# EAGLE design io (EAGLE 9.6.2)
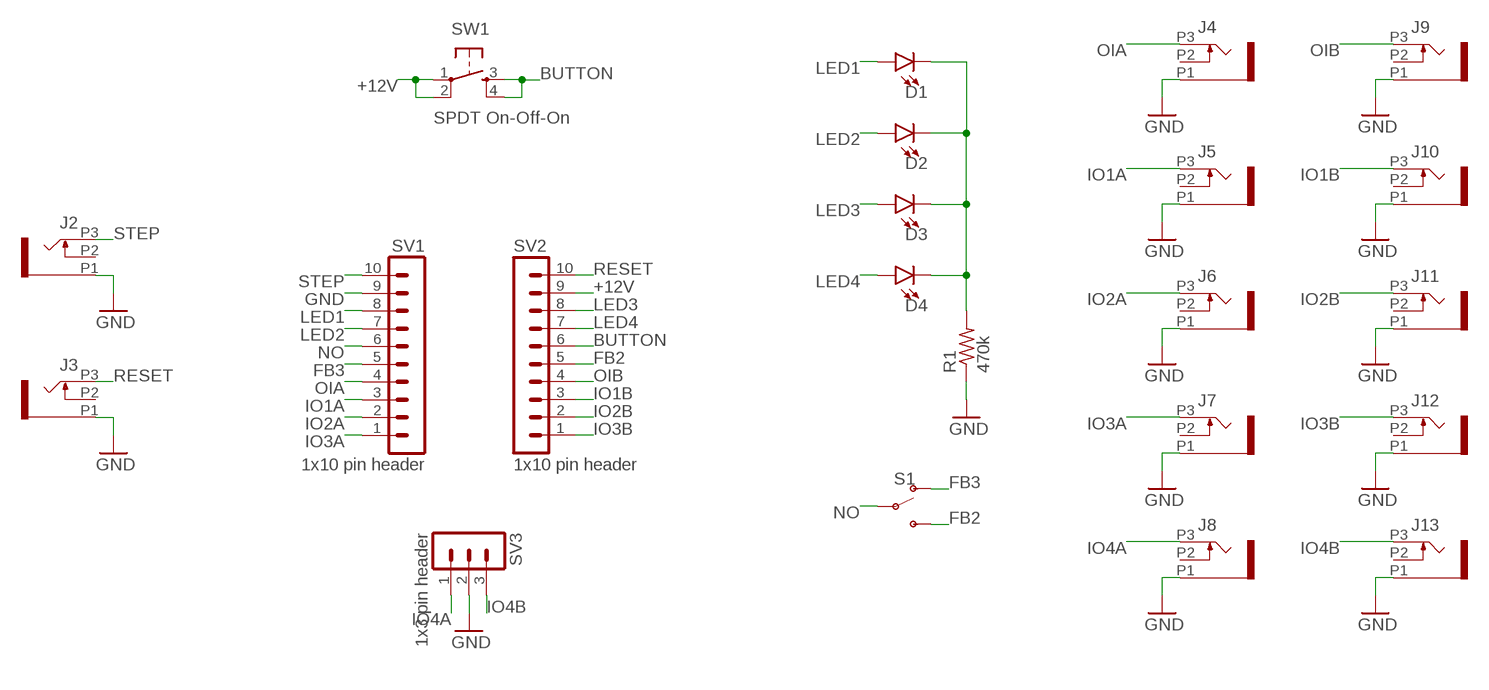
[diagram p0: schematic, sheet 1]

## Parts
D1  LED3MM  [LED_3MM]
D2  LED3MM  [LED_3MM]
D3  LED3MM  [LED_3MM]
D4  LED3MM  [LED_3MM]
J2  PJ301_THONKICONN6  [WQP_PJ_301M6]
J3  PJ301_THONKICONN6  [WQP_PJ_301M6]
J4  PJ301_THONKICONN6  [WQP_PJ_301M6]
J5  PJ301_THONKICONN6  [WQP_PJ_301M6]
J6  PJ301_THONKICONN6  [WQP_PJ_301M6]
J7  PJ301_THONKICONN6  [WQP_PJ_301M6]
J8  PJ301_THONKICONN6  [WQP_PJ_301M6]
J9  PJ301_THONKICONN6  [WQP_PJ_301M6]
J10  PJ301_THONKICONN6  [WQP_PJ_301M6]
J11  PJ301_THONKICONN6  [WQP_PJ_301M6]
J12  PJ301_THONKICONN6  [WQP_PJ_301M6]
J13  PJ301_THONKICONN6  [WQP_PJ_301M6]
R1  470k  R-US_R0603  [R0603]
S1  SWITCH-SPDT-PTH-11.6X4.0MM-SHORT_LEADS  [SWITCH_SPDT_PTH_11.6X4.0MM]
SV1  1x10 pin header  MA10-1  [MA10-1]
SV2  1x10 pin header  MA10-1  [MA10-1]
SV3  1x3 pin header  MA03-1  [MA03-1]
SW1  SPDT On-Off-On  TAC_SWITCHPTH  [TACTILE-PTH]

## Nets
+12V: SV2.9 SW1.1 SW1.2
BUTTON: SV2.6 SW1.3 SW1.4
FB2: S1.3(S) SV2.5
FB3: S1.1(O) SV1.5
GND: J2.P1 J3.P1 J4.P1 J5.P1 J6.P1 J7.P1 J8.P1 J9.P1 J10.P1 J11.P1 J12.P1 J13.P1 R1.1 SV1.9 SV3.2
IO1A: J5.P3 SV1.3
IO1B: J10.P3 SV2.3
IO2A: J6.P3 SV1.2
IO2B: J11.P3 SV2.2
IO3A: J7.P3 SV1.1
IO3B: J12.P3 SV2.1
IO4A: J8.P3 SV3.1
IO4B: J13.P3 SV3.3
LED1: D1.A SV1.8
LED2: D2.A SV1.7
LED3: D3.A SV2.8
LED4: D4.A SV2.7
N$5: D1.K(C) D2.K(C) D3.K(C) D4.K(C) R1.2
NO: S1.2(P) SV1.6
OIA: J4.P3 SV1.4
OIB: J9.P3 SV2.4
RESET: J3.P3 SV2.10
STEP: J2.P3 SV1.10
Unconnected: J2.P2 J3.P2 J4.P2 J5.P2 J6.P2 J7.P2 J8.P2 J9.P2 J10.P2 J11.P2 J12.P2 J13.P2

## Library data of the parts
D1-D4 = SparkFun-LED:LED: LED (Generic) Standard schematic elements and footprints for 5mm, 3mm, 1206, and 0603 sized LEDs. Generic LEDs with no color specified.; PROD_ID: DIO-08794
J2-J13 = og-pj301_variations:PJ301_THONKICONN
R1 = rcl:R-US_: RESISTOR, American symbol; SPICEPREFIX: R
S1 = SparkFun-Switches:SWITCH-SPDT: Single Pole, Double Throw (SPDT) Switch Single-pole, double-throw (SPDT) switch. Variant Overview SMD-AYZ0202 Surface Mount DPDT Switch <https://www.sparkfun.com/products/597> (COM-00597) Used on e.g. LilyPad Arduino USB - ATmega32U4 Board <https://www.sparkfun.com/products/12049> PTH-11.6X4.0MM SPDT Mini Power Switch <https://www.sparkfun.com/products/102> (COM-00102) Used on e.g. SparkFun Simon Says - Through-Hole Soldering Kit <https://www.sparkfun.com/products/10547> (KIT-10547) PTH-11.6X4.0MM-KIT KIT version of SPDT Mini Power Switch - Simplifies soldering by removing tStop of switch pins - only one side can be soldered. PTH-11.6X4.0MM-LOCK LOCK version of SPDT Mini Power Switch - Offset pins hold switch in place for easier soldering. SMD-RIGHT-ANGLE Surface Mount Right Angle Switch <https://www.sparkfun.com/products/10860> (COM-10860) Used on e.g. SparkFun ESP8266 Thing <https://www.sparkfun.com/products/13231>; PROD_ID: SWCH-13151
SV1 SV2 = con-lstb:MA10-1: PIN HEADER; OC_FARNELL: unknown; OC_NEWARK: unknown
SV3 = con-lstb:MA03-1: PIN HEADER; OC_FARNELL: unknown; OC_NEWARK: unknown
SW1 = SparkFun:TAC_SWITCH: Momentary Switch Button commonly used for reset or general input. Spark Fun Electronics SKU : COM-00097

## Net classes
0 default: width 0.406 mm, clearance 0.203 mm

## Board
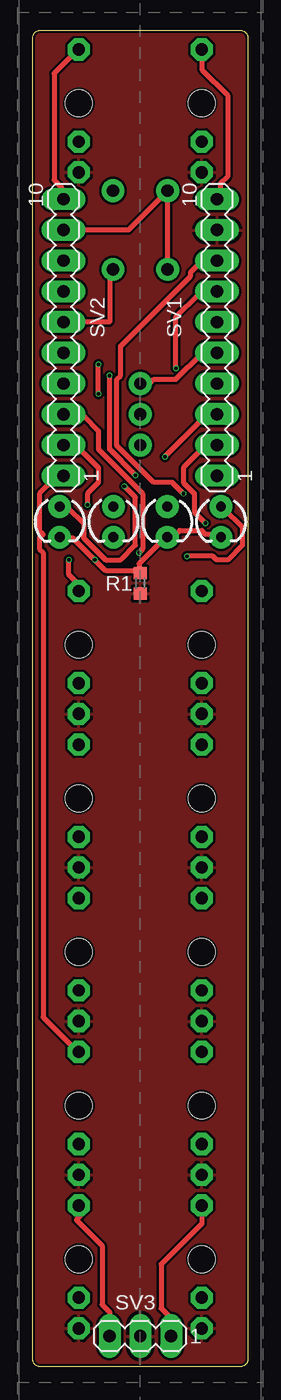
[diagram p1: board, top side]
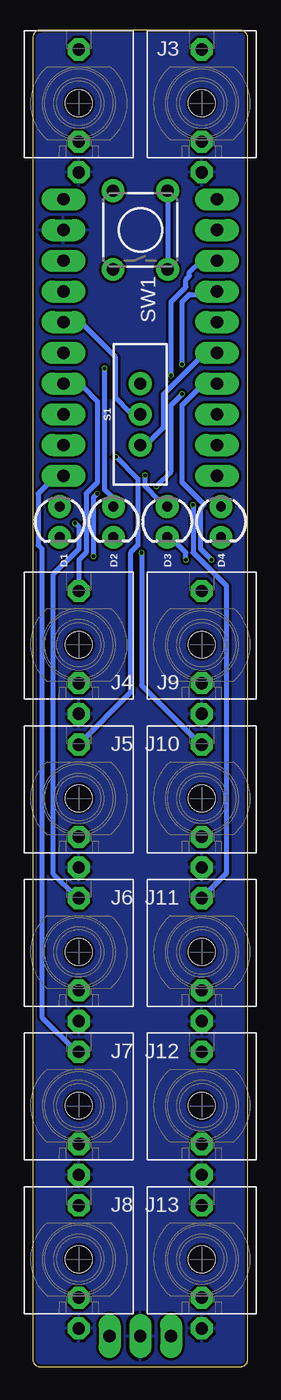
[diagram p2: board, bottom side, seen from below]

Size 17.78 x 110.49 mm. Coordinates in mm from the lower left corner, seen from the top.
Copper layers (1*16): Top 0.035mm / dielectric 1.6mm / Bottom 0.035mm
Design rules "jlcpcb-2layers *": minimum track width 5mil, minimum drill 0.3mm, track to track 5mil, track to pad 5mil, pad to pad 5mil, via to via 10mil, smd to smd 5mil, copper to edge 0.2mm, drill to drill 6mil, minimum pad ring 10mil, minimum via ring 3mil, stop-mask expansion 4mil, vias tented up to drill 0mil, thermal gap 10mil

### Footprints (pad centres in the part's own frame; a part is rotated, then mirrored left to right if it is on the bottom)
LED_3MM = drill 0.813 pad 1.88: A -1.27,0; K 1.27,0
WQP_PJ_301M6 = drill 1.016 pad 1.778 octagon: P1 0,-5.715; P2 0,-3.175; P3 0,4.445 | hole 2.2: 0,0
R0603 = smd 1 x 1.1: 1 -0.85,0; 2 0.85,0
SWITCH_SPDT_PTH_11.6X4.0MM = drill 1.016 pad 1.88: 1 0,2.54; 2 0,0; 3 0,-2.54
MA10-1 = drill 1.016 long: 1 -11.43,0; 2 -8.89,0; 3 -6.35,0; 4 -3.81,0; 5 -1.27,0; 6 1.27,0; 7 3.81,0; 8 6.35,0; 9 8.89,0; 10 11.43,0
MA03-1 = drill 1.016 long: 1 -2.54,0; 2 0,0; 3 2.54,0
TACTILE-PTH = drill 1.016 pad 1.88: 1 -3.251,2.261; 2 3.251,2.261; 3 -3.251,-2.261; 4 3.251,-2.261

### Placement (x,y rotation side)
D1  15.56,69.85 270 bottom
D2  11.11,69.85 270 bottom
D3  6.67,69.85 270 bottom
D4  2.22,69.85 270 bottom
J2  13.97,104.46 0 bottom
J3  3.81,104.46 0 bottom
J4  13.97,59.69 0 bottom
J5  13.97,46.99 0 bottom
J6  13.97,34.29 0 bottom
J7  13.97,21.59 0 bottom
J8  13.97,8.89 0 bottom
J9  3.81,59.69 0 bottom
J10  3.81,46.99 0 bottom
J11  3.81,34.29 0 bottom
J12  3.81,21.59 0 bottom
J13  3.81,8.89 0 bottom
R1  8.89,64.77 90 top
S1  8.89,78.74 0 bottom
SV1  15.24,85.09 90 top
SV2  2.54,85.09 90 top
SV3  8.89,2.54 180 top
SW1  8.89,93.98 90 bottom
U$1  [EURO_PCB_4HP]  -1.27,-8.89 0 top  (outside the outline)

### Tracks (layer width: path | path; a pad name or v marks a point on that pad's centre or on a via)
+12V
  Top 0.406: SW1.2 10.94,97.02 | 10.94,97.02 7.9,93.98 SV2.9 | SW1.1 11.15,96.8 10.94,97.02
BUTTON
  Top 0.406: SW1.3 6.35,90.45 6.35,86.36 SV2.6
  Bottom 0.406: SW1.4 SW1.3
FB2
  Bottom 0.406: SV2.5 2.69,83.77 3.61,83.77 6.96,80.42 6.96,77.67 8.18,76.45 8.79,76.45 S1.3
FB3
  Top 0.406: SV1.5 15.19,83.77 13.97,83.77 11.84,81.64 10.01,81.64 9.7,81.33 9.09,81.33 S1.1
GND
  pour Top: -1.27,110.49 19.05,110.49 19.05,0 -1.27,0
  pour Bottom: 0,110.49 17.78,110.49 17.78,0 0,0
IO1A  (via drill 0.3)
  Top 0.406: v10.92,75.23 14.28,78.59 15.19,78.59 SV1.3
  Bottom 0.406: v10.92,75.23 9.09,73.41 9.09,67.92 9.7,67.31 9.7,55.73 13.97,51.46 J5.P3
IO1B  (via drill 0.3)
  Top 0.406: v8.79,67.31 9.09,67.61 9.09,72.19 5.44,75.84 5.44,77.37 4.22,78.59 2.69,78.59 SV2.3
  Bottom 0.406: v8.79,67.31 8.79,56.34 3.91,51.46 J10.P3
IO2A  (via drill 0.3)
  Top 0.406: v14.28,69.75 13.36,70.66 13.36,72.19 12.45,73.1 12.45,74.32 14.28,76.15 15.19,76.15 SV1.2
  Bottom 0.406: v14.28,69.75 13.97,69.44 13.97,67.61 16.1,65.48 16.1,40.79 14.28,38.96 13.97,38.96 J6.P3
IO2B  (via drill 0.3)
  Top 0.406: v4.52,71.27 4.52,72.19 5.44,73.1 5.44,74.32 3.61,76.15 2.69,76.15 SV2.2
  Bottom 0.406: v4.52,71.27 4.52,67.31 1.78,64.57 1.78,40.79 3.61,38.96 J11.P3
IO3A
  Bottom 0.406: J7.P3 13.97,26.16 14.28,26.16 17.02,28.91 17.02,67.61 17.32,67.92 17.32,72.19 16.1,73.41 15.49,73.41 SV1.1
IO3B
  Top 0.406: J12.P3 3.61,26.16 0.86,28.91 0.86,67.31 0.56,67.61 0.56,68.53 0.86,68.83 0.56,69.14 0.56,72.19 1.78,73.41 2.39,73.41 SV2.1
IO4A
  Top 0.406: J8.P3 13.97,11.84 10.62,8.48 10.62,4.83 11.23,4.22 11.23,2.69 SV3.1
IO4B
  Top 0.406: SV3.3 6.35,4.52 5.74,5.13 5.74,10.01 3.61,12.14 3.91,12.45 3.91,13.06 J13.P3
LED1  (via drill 0.3)
  Top 0.406: v12.45,72.19 11.53,73.1 10.01,73.1 6.96,76.15 6.96,81.64 7.26,81.94 7.26,84.38 13.06,90.17 13.06,90.47 13.97,91.39 15.19,91.39 SV1.8 | v12.75,67 14.88,67 15.19,66.7 16.1,66.7 17.32,67.92 17.32,69.44 15.8,70.97 D1.A
  Bottom 0.406: v12.45,72.19 12.75,71.88 v12.75,67
LED2  (via drill 0.3)
  Top 0.406: v11.84,82.55 11.84,86.82 13.67,88.65 15.19,88.65 SV1.7
  Bottom 0.406: v11.84,82.55 11.84,72.49 11.23,71.88 11.23,71.27 D2.A
LED3  (via drill 0.3)
  Top 0.406: v6.35,81.94 6.35,75.84 v8.48,73.71
  Bottom 0.406: v6.35,81.94 6.35,88.04 5.13,89.26 5.13,89.86 4.83,90.17 4.83,90.47 3.91,91.39 2.69,91.39 SV2.8 | v8.48,73.71 8.48,72.8 7.26,71.58 6.96,71.58 6.65,71.27 D3.A
LED4  (via drill 0.3)
  Top 0.406: v5.44,80.42 v5.44,82.86 | v7.57,72.8 8.48,71.88 8.48,67.92 7.26,66.7 6.04,66.7 4.22,68.53 4.22,69.75 3,70.97 2.39,70.97 D4.A
  Bottom 0.406: v5.44,82.86 5.44,88.04 4.83,88.65 2.69,88.65 SV2.7 | v5.44,80.42 6.35,79.5 6.35,74.02 v7.57,72.8
N$5  (via drill 0.3)
  Top 0.406: 8.79,65.79 8.79,66.4 10.92,68.53 D2.K 11.23,68.83 11.84,68.83 12.14,69.14 13.97,69.14 14.28,68.83 15.49,68.83 D1.K | 8.79,65.79 6.04,65.79 v5.13,66.7 3.3,68.53 2.39,68.53 D4.K | 8.79,65.79 R1.2
  Bottom 0.406: v5.13,66.7 5.13,67.31 6.35,68.53 6.65,68.53 D3.K
NO
  Bottom 0.406: SV1.6 15.19,86.21 13.67,86.21 10.92,83.46 10.92,80.11 9.7,78.89 9.09,78.89 S1.2
OIA
  Bottom 0.406: J4.P3 13.97,66.7 13.36,67.31 13.36,72.19 12.45,73.1 12.45,79.81 13.67,81.03 15.19,81.03 SV1.4
OIB  (via drill 0.3)
  Top 0.406: v3,66.7 3,65.48 3.61,64.87 3.61,64.26 J9.P3
  Bottom 0.406: v3,66.7 3.91,67.61 3.91,70.97 3.61,71.27 5.44,73.1 5.44,79.5 3.91,81.03 2.69,81.03 SV2.4
RESET
  Top 0.406: SV2.10 2.39,96.57 2.39,97.48 1.78,98.09 1.78,106.93 3.61,108.76 J3.P3
STEP
  Top 0.406: J2.P3 13.97,107.24 16.1,105.11 16.1,98.4 15.49,97.79 15.49,96.57 SV1.10